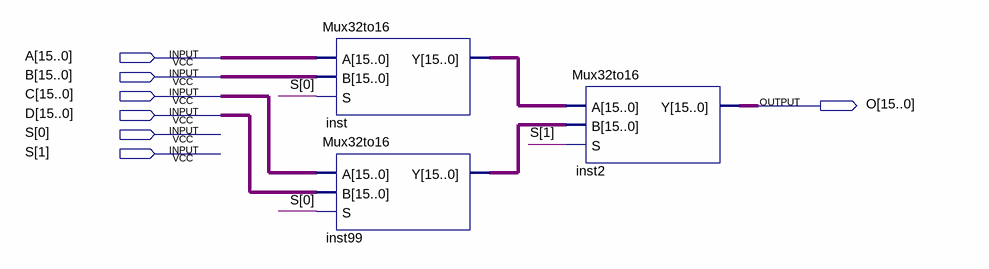
[diagram p0: schematic sheet]
// Quartus schematic mux48to16.bdf as structural Verilog: 3 symbols, 7 pins
module mux48to16 (
  input  [15:0] A,
  input  [15:0] B,
  input  [15:0] C,
  input  [15:0] D,
  input  [1:0] S,
  output [15:0] O
);

  wire [15:0] inst99_y, inst_y;

  Mux32to16 inst (.A(A), .B(B), .S(S[0]), .Y(inst_y));
  Mux32to16 inst99 (.A(C), .B(D), .S(S[0]), .Y(inst99_y));
  Mux32to16 inst2 (.A(inst_y), .B(inst99_y), .S(S[1]), .Y(O));
endmodule
